# Altium project IOT_SWITCH.PrjPcb
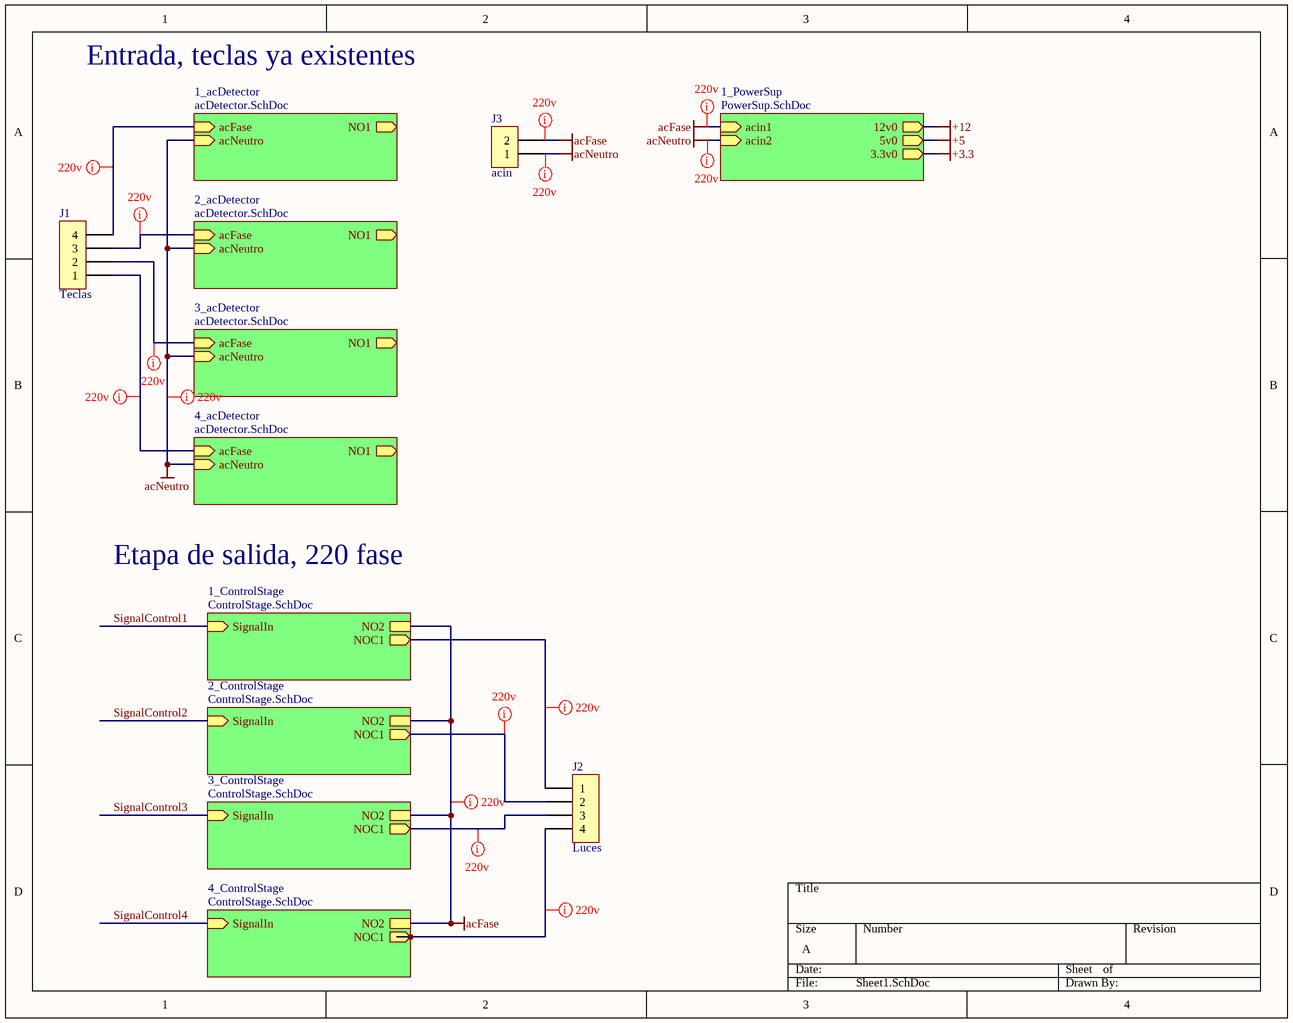
[diagram p0: Sheet1.SchDoc]
4 sheets, 47 parts. Net scope: hierarchical (ports join the sheet entries above them; power ports are global).
Board file: PCB1.PcbDoc
Sheets:
  Sheet1.SchDoc
    1_acDetector = acDetector.SchDoc
    2_acDetector = acDetector.SchDoc
    3_acDetector = acDetector.SchDoc
    4_acDetector = acDetector.SchDoc
    1_ControlStage = ControlStage.SchDoc
    2_ControlStage = ControlStage.SchDoc
    3_ControlStage = ControlStage.SchDoc
    4_ControlStage = ControlStage.SchDoc
    1_PowerSup = PowerSup.SchDoc

## Sheet Sheet1.SchDoc
size A

### Parts
J1  Teclas  [BORNERA4]
J2  Luces  [BORNERA4]
J3  acin  [BORNERA2]

### Sub-sheets
1_acDetector = acDetector.SchDoc: acFase (in), acNeutro (in), NO1 (out)
1_ControlStage = ControlStage.SchDoc: SignalIn (in), NO2, NOC1 (out)
1_PowerSup = PowerSup.SchDoc: 12v0 (out), 5v0 (out), 3.3v0 (out), acin1 (in), acin2 (in)
2_acDetector = acDetector.SchDoc: acFase (in), acNeutro (in), NO1 (out)
2_ControlStage = ControlStage.SchDoc: SignalIn (in), NO2, NOC1 (out)
3_acDetector = acDetector.SchDoc: acFase (in), acNeutro (in), NO1 (out)
3_ControlStage = ControlStage.SchDoc: SignalIn (in), NO2, NOC1 (out)
4_acDetector = acDetector.SchDoc: acFase (in), acNeutro (in), NO1 (out)
4_ControlStage = ControlStage.SchDoc: SignalIn (in), NO2, NOC1 (out)

### Nets
acFase: J3.2 ; sheet 1_ControlStage/NO2, sheet 2_ControlStage/NO2, sheet 3_ControlStage/NO2, sheet 4_ControlStage/NO2, sheet 1_PowerSup/acin1
acNeutro: J3.1 ; sheet 1_acDetector/acNeutro, sheet 2_acDetector/acNeutro, sheet 3_acDetector/acNeutro, sheet 4_acDetector/acNeutro, sheet 1_PowerSup/acin2
NetACDBR_1_acDetector_2: J1.4 ; sheet 1_acDetector/acFase
NetACDBR_2_acDetector_2: J1.3 ; sheet 2_acDetector/acFase
NetACDBR_3_acDetector_2: J1.2 ; sheet 3_acDetector/acFase
NetACDBR_4_acDetector_2: J1.1 ; sheet 4_acDetector/acFase
NetJ2_1: J2.1 ; sheet 1_ControlStage/NOC1
NetJ2_2: J2.2 ; sheet 2_ControlStage/NOC1
NetJ2_3: J2.3 ; sheet 3_ControlStage/NOC1
NetJ2_4: J2.4 ; sheet 4_ControlStage/NOC1

### Layout directives
mark named 220v: acFase, acNeutro, NetACDBR_1_acDetector_2, NetACDBR_2_acDetector_2, NetACDBR_3_acDetector_2, NetACDBR_4_acDetector_2, NetJ2_1, NetJ2_2, NetJ2_3, NetJ2_4

### Notes on the sheet
- Entrada, teclas ya existentes
- Etapa de salida, 220 fase

### Library data of the parts
J1 J2 = BORNERA 4
J3 = BORNERA 2

## Sheet acDetector.SchDoc
size A
Used 4 times, as channels 1_acDetector, 2_acDetector, 3_acDetector, 4_acDetector. Parts and nets are listed once, with the designators drawn on the sheet.
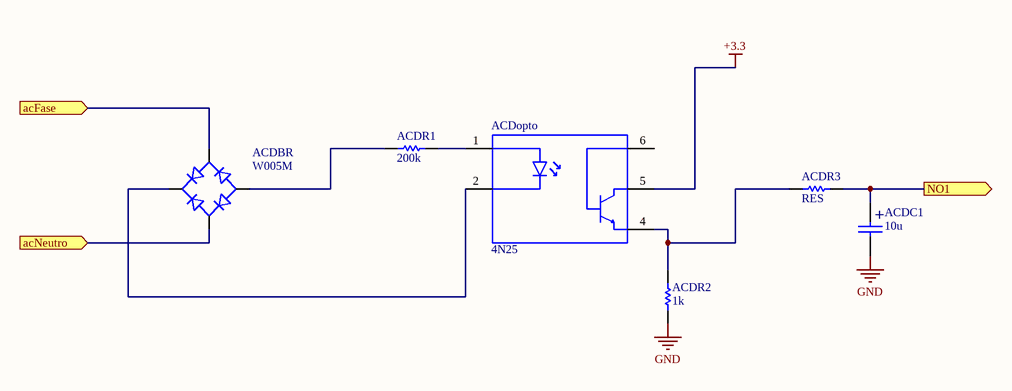
[diagram p1: acDetector.SchDoc]

### Parts
ACDBR  W005M  [DIOB_W005M]
ACDC1  10u  [CAP100RP]
ACDopto  4N25  [DIP6]
ACDR1  200k  [RES400]
ACDR2  1k  [RES400]
ACDR3  RES  [RES400]

### Ports
acFase (in), acNeutro (in), NO1 (out)

### Nets
+3.3: ACDopto.5(C)
GND: ACDC1.2 ACDR2.1
acFase: ACDBR.2(AC1) ; port acFase
acNeutro: ACDBR.4(AC2) ; port acNeutro
NO1: ACDC1.1 ACDR3.2 ; port NO1
NetACDBR_1: ACDBR.1(POS) ACDopto.2(K)
NetACDBR_3: ACDBR.3(NEG) ACDR1.1
NetACDopto_1: ACDopto.1(A) ACDR1.2
NetACDopto_4: ACDopto.4(E) ACDR2.2 ACDR3.1

Not connected (* = marked no-connect by the designer): ACDopto 6(B)

### Channels
1_acDetector: designators end in _1_acDetector; ports acFase=NetACDBR_1_acDetector_2 acNeutro=acNeutro NO1=NetACDC1_1_acDetector_1
2_acDetector: designators end in _2_acDetector; ports acFase=NetACDBR_2_acDetector_2 acNeutro=acNeutro NO1=NetACDC1_2_acDetector_1
3_acDetector: designators end in _3_acDetector; ports acFase=NetACDBR_3_acDetector_2 acNeutro=acNeutro NO1=NetACDC1_3_acDetector_1
4_acDetector: designators end in _4_acDetector; ports acFase=NetACDBR_4_acDetector_2 acNeutro=acNeutro NO1=NetACDC1_4_acDetector_1

### Notes on the sheet
- (in symbol CAPPOL) +

### Library data of the parts
ACDBR = W005M: Bridge Rectifier Single Phase Standard 50V Through Hole WOM; MF: GeneSiC Semiconductor; Value: *; Availability: Unavailable; Price: None; MP: W005M; Package: 4-4 Rectron; SnapEDA_Link: https://www.snapeda.com/parts/W005M/GeneSiC%20Semiconductor/view-part/1824904/?ref=snap
ACDC1 = CAPPOL
ACDopto = 4N25: Optoisolator Transistor with Base Output 5000Vrms 1 Channel 6-DIP; MF: Vishay Semiconductor; Package: DIP-6 Lite-On; Value: *; Price: None; MP: 4N25; SnapEDA_Link: https://www.snapeda.com/parts/4N25/Vishay%20Semiconductor%20Opto%20Division/view-part/641454/?ref=snap; Availability: Unavailable
ACDR1 ACDR2 = RES

## Sheet ControlStage.SchDoc
size A
Used 4 times, as channels 1_ControlStage, 2_ControlStage, 3_ControlStage, 4_ControlStage. Parts and nets are listed once, with the designators drawn on the sheet.
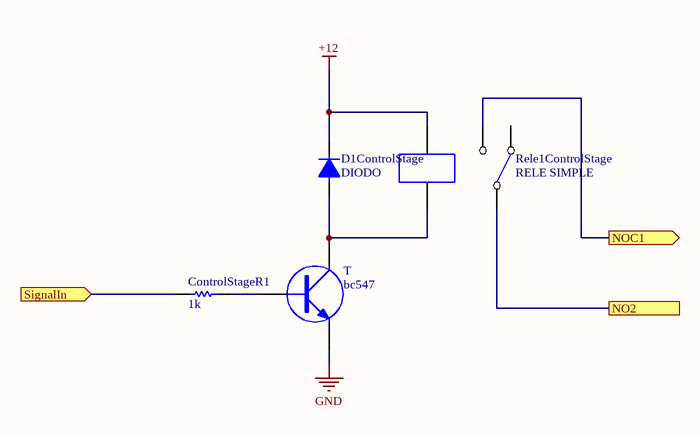
[diagram p2: ControlStage.SchDoc]

### Parts
ControlStageR1  1k  [RES400]
D1ControlStage  DIODO  [DO41]
Rele1ControlStage  RELE SIMPLE  [RELE SERIE 964]
T  bc547  [TO-220 H - DISIPADOR]

### Ports
NO2, NOC1 (out), SignalIn (in)

### Nets
+12: D1ControlStage.2 Rele1ControlStage.B1
GND: T.3(E)
NO2: Rele1ControlStage.C1 ; port NO2
NOC1: Rele1ControlStage.NA1 ; port NOC1
SignalIn: ControlStageR1.1 ; port SignalIn
NetControlStageR1_2: ControlStageR1.2 T.1(B)
NetD1ControlStage_1: D1ControlStage.1 Rele1ControlStage.B2 T.2(C)

Not connected (* = marked no-connect by the designer): Rele1ControlStage NC1

### Channels
1_ControlStage: designators end in _1_ControlStage; ports NO2=acFase NOC1=NetJ2_1 SignalIn=SignalControl1
2_ControlStage: designators end in _2_ControlStage; ports NO2=acFase NOC1=NetJ2_2 SignalIn=SignalControl2
3_ControlStage: designators end in _3_ControlStage; ports NO2=acFase NOC1=NetJ2_3 SignalIn=SignalControl3
4_ControlStage: designators end in _4_ControlStage; ports NO2=acFase NOC1=NetJ2_4 SignalIn=SignalControl4

### Library data of the parts
ControlStageR1 = RES
T = TRANSISTOR NPN

## Sheet PowerSup.SchDoc
size A
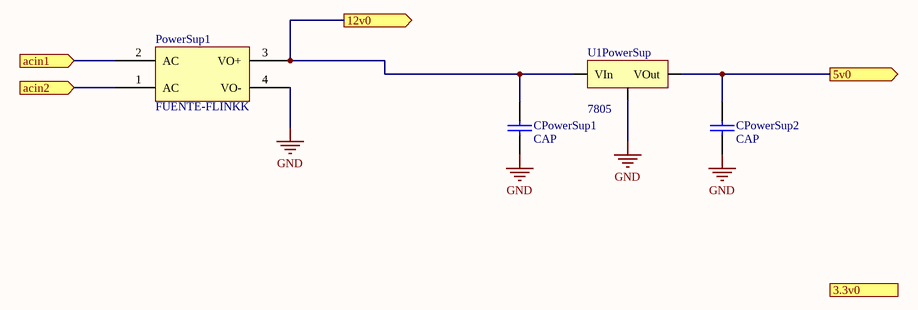
[diagram p3: PowerSup.SchDoc]

### Parts
CPowerSup1  CAP  [CAP200]
CPowerSup2  CAP  [CAP200]
PowerSup1  FUENTE-FLINKK  [FUENTE-HLINK]
U1PowerSup  7805  [TO-220 H - DISIPADOR]

### Ports
3.3v0 (out), 5v0 (out), 12v0 (out), acin1 (in), acin2 (in)

### Nets
+5: CPowerSup2.1 U1PowerSup.3(VOut) ; port 5v0
+12: CPowerSup1.1 PowerSup1.3(VO+) U1PowerSup.1(VIn) ; port 12v0
acFase: PowerSup1.2(AC) ; port acin1
acNeutro: PowerSup1.1(AC) ; port acin2
GND: CPowerSup1.2 CPowerSup2.2 PowerSup1.4(VO-) U1PowerSup.2(GND)

### Library data of the parts
U1PowerSup = 78XX: REGULDOR POSITIVO

## Nets that join several sheets
+3.3: 1_acDetector (ACDopto_1_acDetector.5), 2_acDetector (ACDopto_2_acDetector.5), 3_acDetector (ACDopto_3_acDetector.5), 4_acDetector (ACDopto_4_acDetector.5)
+12: 1_ControlStage (D1ControlStage_1_ControlStage.2 Rele1ControlStage_1_ControlStage.B1), 2_ControlStage (D1ControlStage_2_ControlStage.2 Rele1ControlStage_2_ControlStage.B1), 3_ControlStage (D1ControlStage_3_ControlStage.2 Rele1ControlStage_3_ControlStage.B1), 4_ControlStage (D1ControlStage_4_ControlStage.2 Rele1ControlStage_4_ControlStage.B1), PowerSup (CPowerSup1.1 PowerSup1.3 U1PowerSup.1)
acFase: Sheet1 (J3.2), 1_ControlStage (Rele1ControlStage_1_ControlStage.C1), 2_ControlStage (Rele1ControlStage_2_ControlStage.C1), 3_ControlStage (Rele1ControlStage_3_ControlStage.C1), 4_ControlStage (Rele1ControlStage_4_ControlStage.C1), PowerSup (PowerSup1.2)
acNeutro: Sheet1 (J3.1), 1_acDetector (ACDBR_1_acDetector.4), 2_acDetector (ACDBR_2_acDetector.4), 3_acDetector (ACDBR_3_acDetector.4), 4_acDetector (ACDBR_4_acDetector.4), PowerSup (PowerSup1.1)
GND: 1_acDetector (ACDC1_1_acDetector.2 ACDR2_1_acDetector.1), 2_acDetector (ACDC1_2_acDetector.2 ACDR2_2_acDetector.1), 3_acDetector (ACDC1_3_acDetector.2 ACDR2_3_acDetector.1), 4_acDetector (ACDC1_4_acDetector.2 ACDR2_4_acDetector.1), 1_ControlStage (T_1_ControlStage.3), 2_ControlStage (T_2_ControlStage.3), 3_ControlStage (T_3_ControlStage.3), 4_ControlStage (T_4_ControlStage.3), PowerSup (CPowerSup1.2 CPowerSup2.2 PowerSup1.4 U1PowerSup.2)
NetACDBR_1_acDetector_2: Sheet1 (J1.4), 1_acDetector (ACDBR_1_acDetector.2)
NetACDBR_2_acDetector_2: Sheet1 (J1.3), 2_acDetector (ACDBR_2_acDetector.2)
NetACDBR_3_acDetector_2: Sheet1 (J1.2), 3_acDetector (ACDBR_3_acDetector.2)
NetACDBR_4_acDetector_2: Sheet1 (J1.1), 4_acDetector (ACDBR_4_acDetector.2)
NetJ2_1: Sheet1 (J2.1), 1_ControlStage (Rele1ControlStage_1_ControlStage.NA1)
NetJ2_2: Sheet1 (J2.2), 2_ControlStage (Rele1ControlStage_2_ControlStage.NA1)
NetJ2_3: Sheet1 (J2.3), 3_ControlStage (Rele1ControlStage_3_ControlStage.NA1)
NetJ2_4: Sheet1 (J2.4), 4_ControlStage (Rele1ControlStage_4_ControlStage.NA1)